# Altium schematic sheet Keyboard.SchDoc
size B
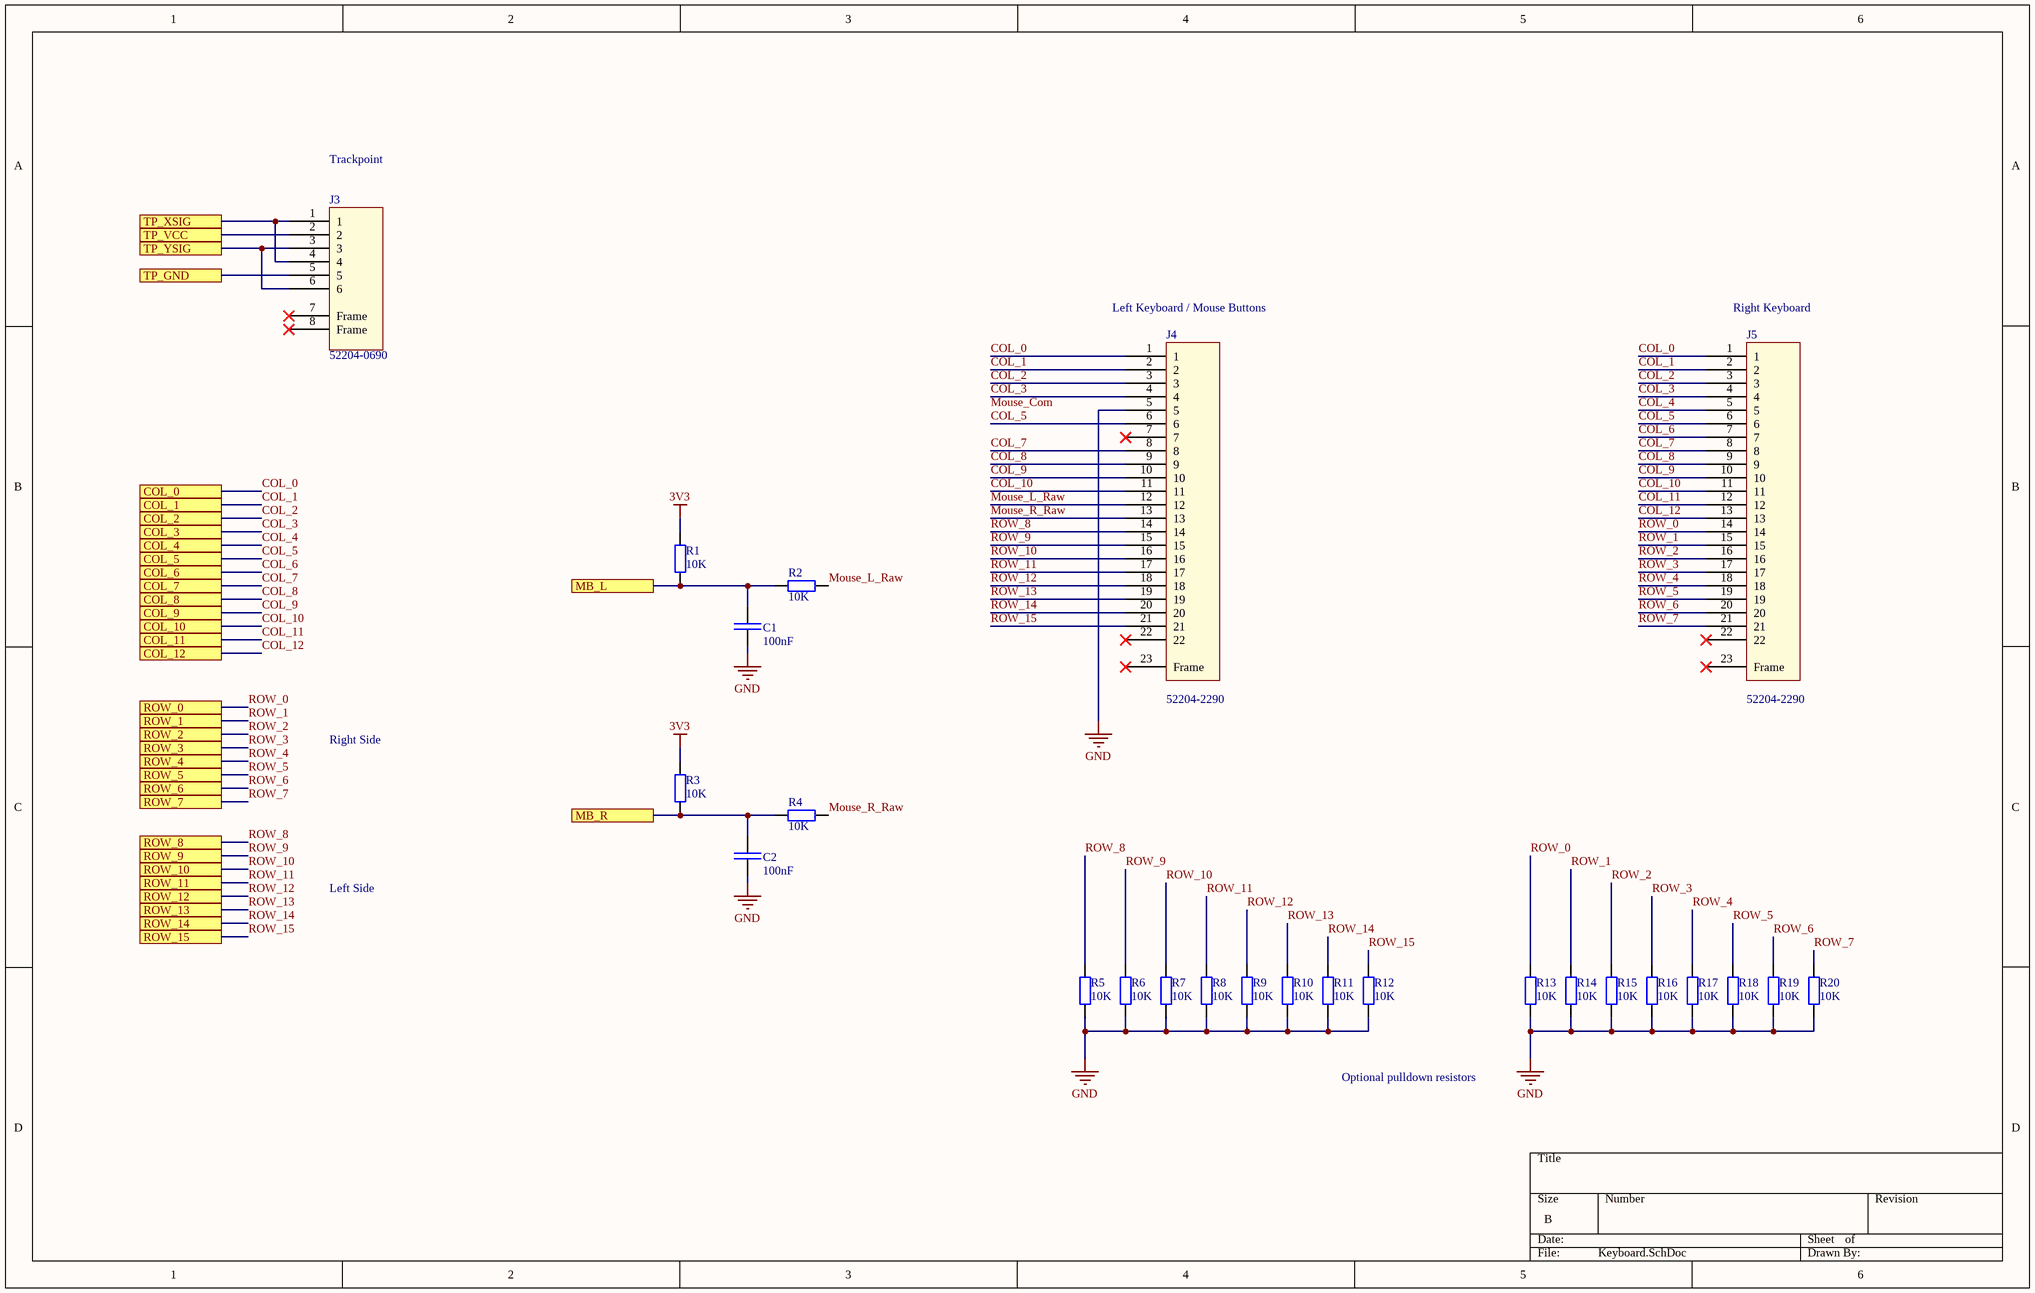
[diagram p0: Keyboard.SchDoc]

## Parts
C1  100nF  [CAP_SM0603_YAGEOCC2_N]
C2  100nF  [CAP_SM0603_YAGEOCC2_N]
J3  52204-0690  [52204-0690]
J4  52204-2290  [52204-2290]
J5  52204-2290  [52204-2290]
R1  10K  [RES_SM0603_YAGEORC_N]
R2  10K  [RES_SM0603_YAGEORC_N]
R3  10K  [RES_SM0603_YAGEORC_N]
R4  10K  [RES_SM0603_YAGEORC_N]
R5  10K  [RES_SM0603_YAGEORC_N]
R6  10K  [RES_SM0603_YAGEORC_N]
R7  10K  [RES_SM0603_YAGEORC_N]
R8  10K  [RES_SM0603_YAGEORC_N]
R9  10K  [RES_SM0603_YAGEORC_N]
R10  10K  [RES_SM0603_YAGEORC_N]
R11  10K  [RES_SM0603_YAGEORC_N]
R12  10K  [RES_SM0603_YAGEORC_N]
R13  10K  [RES_SM0603_YAGEORC_N]
R14  10K  [RES_SM0603_YAGEORC_N]
R15  10K  [RES_SM0603_YAGEORC_N]
R16  10K  [RES_SM0603_YAGEORC_N]
R17  10K  [RES_SM0603_YAGEORC_N]
R18  10K  [RES_SM0603_YAGEORC_N]
R19  10K  [RES_SM0603_YAGEORC_N]
R20  10K  [RES_SM0603_YAGEORC_N]

## Ports
COL_0, COL_1, COL_2, COL_3, COL_4, COL_5, COL_6, COL_7, COL_8, COL_9, COL_10, COL_11, COL_12, MB_L, MB_R, ROW_0, ROW_1, ROW_2, ROW_3, ROW_4, ROW_5, ROW_6, ROW_7, ROW_8, ROW_9, ROW_10, ROW_11, ROW_12, ROW_13, ROW_14, ROW_15, TP_GND, TP_VCC, TP_XSIG, TP_YSIG

## Nets
3V3: R1.1 R3.1
GND: C1.1 C2.1 J4.5 R5.2 R6.2 R7.2 R8.2 R9.2 R10.2 R11.2 R12.2 R13.2 R14.2 R15.2 R16.2 R17.2 R18.2 R19.2 R20.2
COL_0: J4.1 J5.1 ; port COL_0
COL_1: J4.2 J5.2 ; port COL_1
COL_2: J4.3 J5.3 ; port COL_2
COL_3: J4.4 J5.4 ; port COL_3
COL_4: J5.5 ; port COL_4
COL_5: J4.6 J5.6 ; port COL_5
COL_6: J5.7 ; port COL_6
COL_7: J4.8 J5.8 ; port COL_7
COL_8: J4.9 J5.9 ; port COL_8
COL_9: J4.10 J5.10 ; port COL_9
COL_10: J4.11 J5.11 ; port COL_10
COL_11: J5.12 ; port COL_11
COL_12: J5.13 ; port COL_12
MB_L: C1.2 R1.2 R2.2 ; port MB_L
MB_R: C2.2 R3.2 R4.2 ; port MB_R
Mouse_L_Raw: J4.12 R2.1
Mouse_R_Raw: J4.13 R4.1
ROW_0: J5.14 R13.1 ; port ROW_0
ROW_1: J5.15 R14.1 ; port ROW_1
ROW_2: J5.16 R15.1 ; port ROW_2
ROW_3: J5.17 R16.1 ; port ROW_3
ROW_4: J5.18 R17.1 ; port ROW_4
ROW_5: J5.19 R18.1 ; port ROW_5
ROW_6: J5.20 R19.1 ; port ROW_6
ROW_7: J5.21 R20.1 ; port ROW_7
ROW_8: J4.14 R5.1 ; port ROW_8
ROW_9: J4.15 R6.1 ; port ROW_9
ROW_10: J4.16 R7.1 ; port ROW_10
ROW_11: J4.17 R8.1 ; port ROW_11
ROW_12: J4.18 R9.1 ; port ROW_12
ROW_13: J4.19 R10.1 ; port ROW_13
ROW_14: J4.20 R11.1 ; port ROW_14
ROW_15: J4.21 R12.1 ; port ROW_15
TP_GND: J3.5 ; port TP_GND
TP_VCC: J3.2 ; port TP_VCC
TP_XSIG: J3.1 J3.4 ; port TP_XSIG
TP_YSIG: J3.3 J3.6 ; port TP_YSIG

Not connected (* = marked no-connect by the designer): J3 7(Frame)* 8(Frame)*; J4 7* 22* 23(Frame)*; J5 22* 23(Frame)*

## Notes on the sheet
- Trackpoint
- (near J4) Left Keyboard / Mouse Buttons
- (near J5) Right Keyboard
- Right Side
- Left Side
- Optional pulldown resistors
- Labels drawn without touching a wire or pin: Mouse_Com

## Library data of the parts
C1 C2 = CC0603KRX7R9BB104: CAP 100nF SM0603 X7R 50V YAGEO CC2; Tolerance (%): 10; Voltage Rating (Volts): 50; Value: 100nF; Category: Capacitor; Manufacturer: Yageo; Manufacturer Part Number: CC0603KRX7R9BB104; Package: 0603; Supplier Part Number 1: 1362556; Supplier 1: Farnell; ComponentLink1URL: http://www.yageo.com; ComponentLink1Description: Manufacturer Website; Supplier 2: Digi-Key; Supplier Part Number 2: 311-1344-1-ND
R1-R20 = RC0603FR-0710KL: RES 10K SM0603 YAGEO RC_L; Power (Watts): 0.1; Resistance (Ohms): 10000; Tolerance (%): 1; Value: 10K; Category: Resistor; Manufacturer: Yageo; Manufacturer Part Number: RC0603FR-0710KL; Package: 0603; Supplier Part Number 1: 9238603; Supplier 1: Farnell; ComponentLink1URL: http://www.yageo.com; ComponentLink1Description: Manufacturer Website; Supplier 2: Digi-Key; Supplier Part Number 2: 311-10.0KHRCT-ND